# Altium project picr22-team-snax-mainboard.PrjPcb
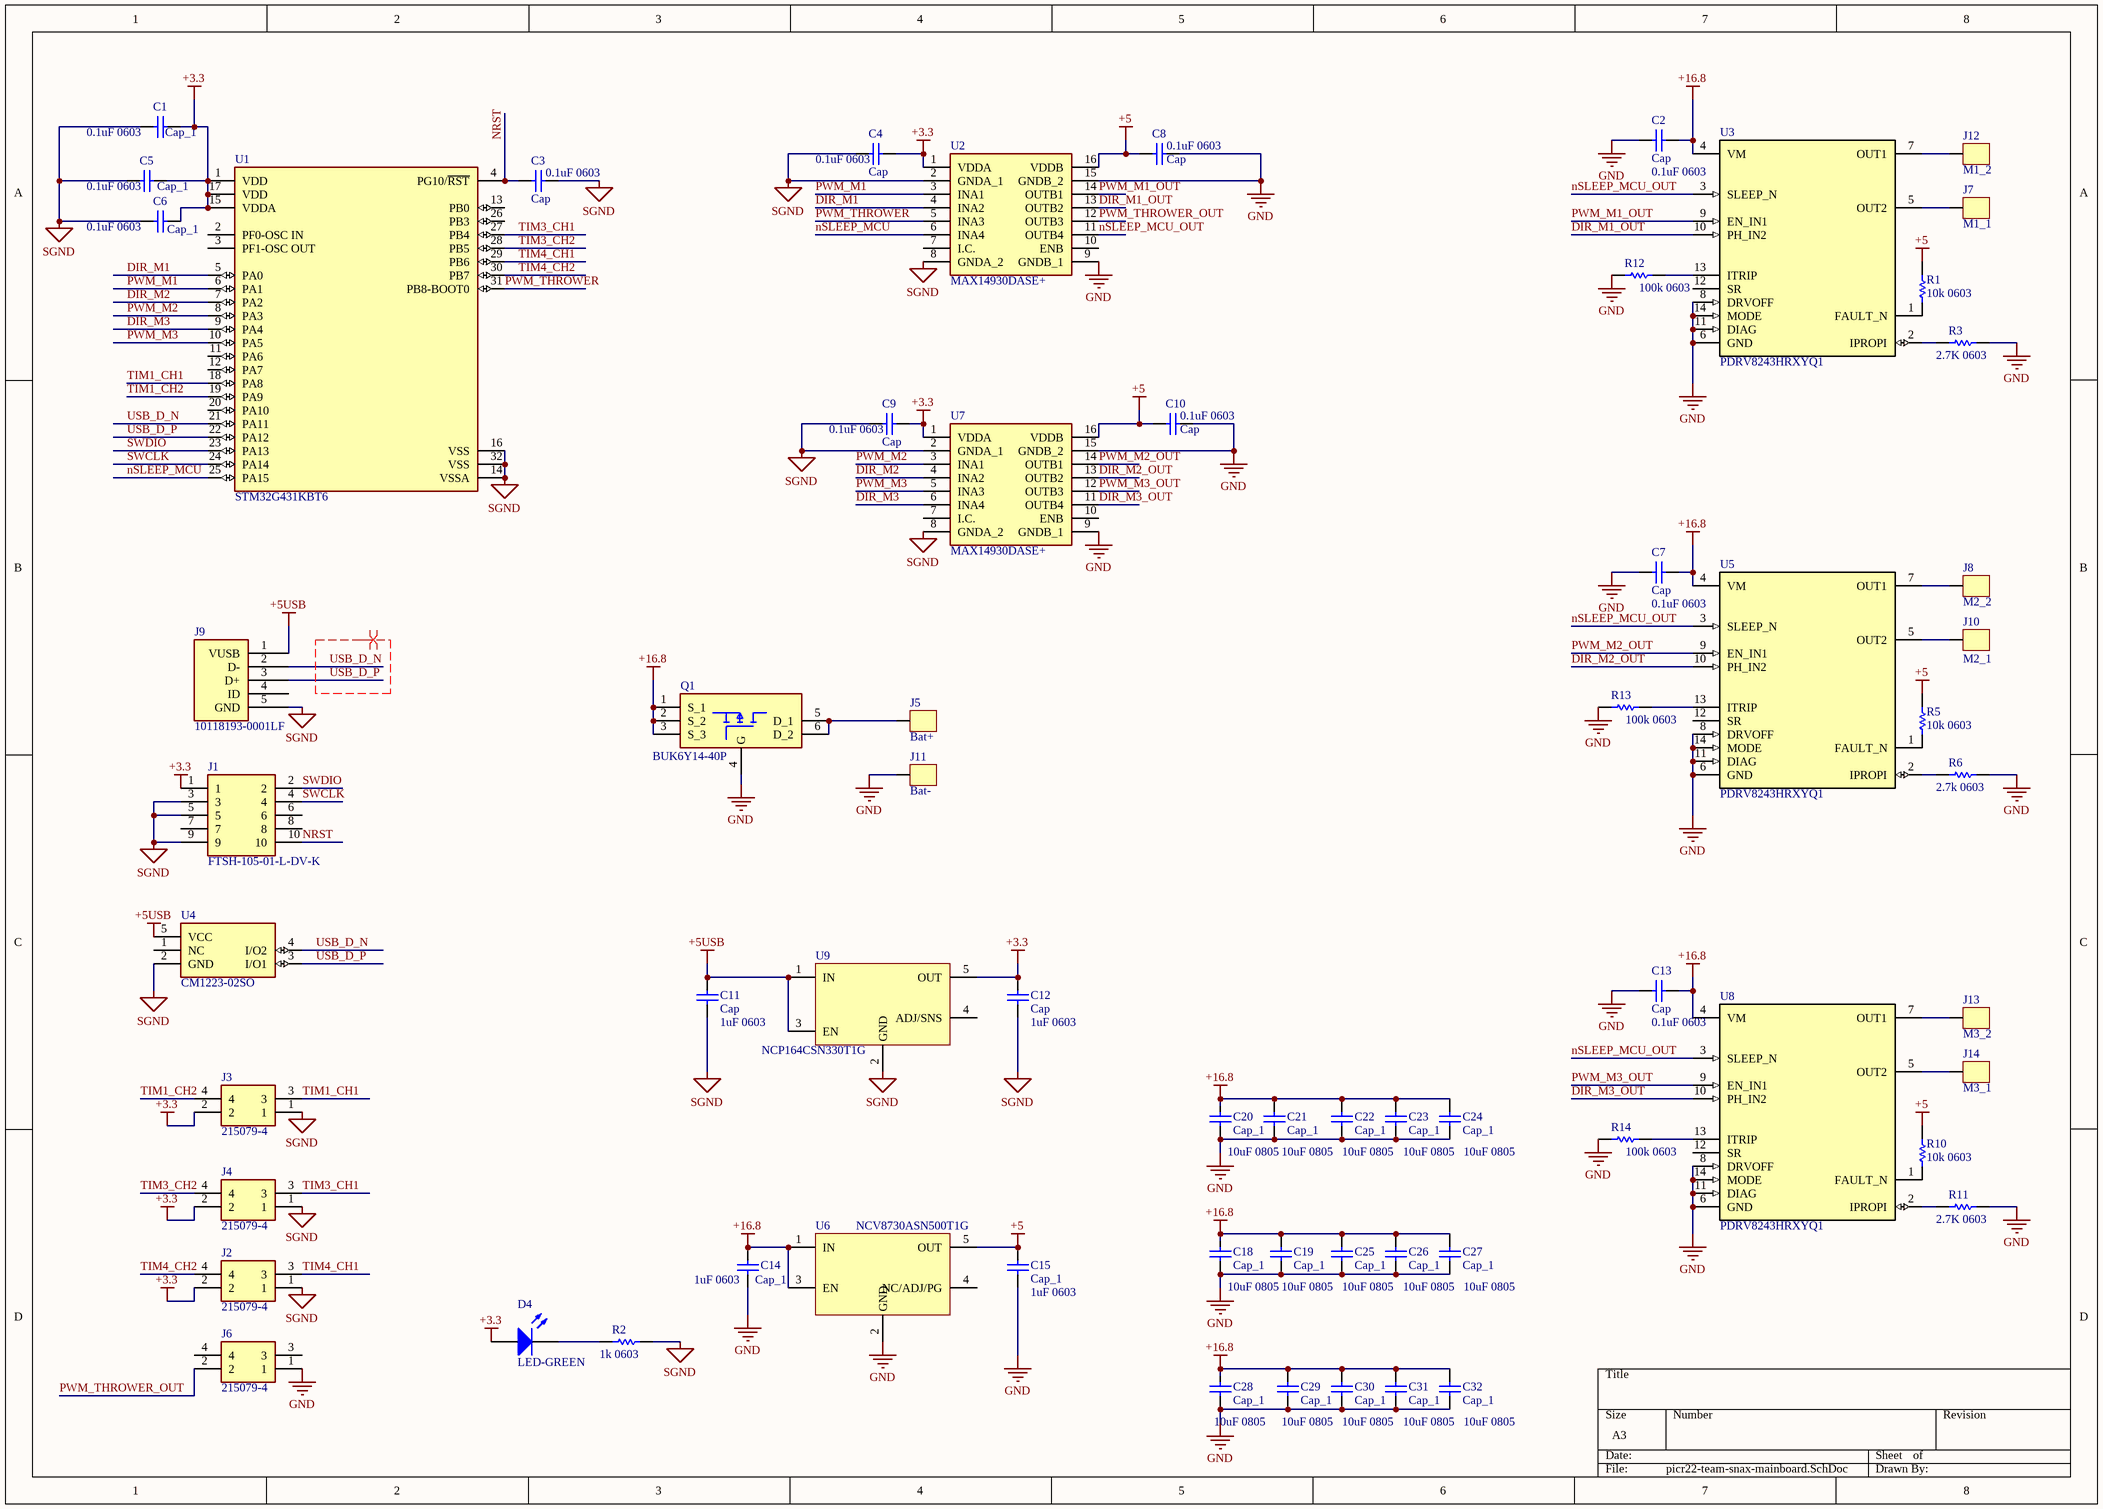
[diagram p0: picr22-team-snax-mainboard.SchDoc]
1 sheet, 65 parts. Net scope: global (net labels, ports and power ports of the same name join across sheets).
Board file: team-snax-mainboard.PcbDoc

## Sheet picr22-team-snax-mainboard.SchDoc
size A3; SheetNumber: 1; SheetTotal: 1

### Parts
C1  Cap_1  value 0.1uF 0603  [Cap_0603]
C2  Cap  value 0.1uF 0603  [Cap_0603]
C3  Cap  value 0.1uF 0603  [Cap_0603]
C4  Cap  value 0.1uF 0603  [Cap_0603]
C5  Cap_1  value 0.1uF 0603  [Cap_0603]
C6  Cap_1  value 0.1uF 0603  [Cap_0603]
C7  Cap  value 0.1uF 0603  [Cap_0603]
C8  Cap  value 0.1uF 0603  [Cap_0603]
C9  Cap  value 0.1uF 0603  [Cap_0603]
C10  Cap  value 0.1uF 0603  [Cap_0603]
C11  Cap  value 1uF 0603  [Cap_0603]
C12  Cap  value 1uF 0603  [Cap_0603]
C13  Cap  value 0.1uF 0603  [Cap_0603]
C14  Cap_1  value 1uF 0603  [Cap_0603]
C15  Cap_1  value 1uF 0603  [Cap_0603]
C18  Cap_1  value 10uF 0805  [CAP_0805]
C19  Cap_1  value 10uF 0805  [CAP_0805]
C20  Cap_1  value 10uF 0805  [CAP_0805]
C21  Cap_1  value 10uF 0805  [CAP_0805]
C22  Cap_1  value 10uF 0805  [CAP_0805]
C23  Cap_1  value 10uF 0805  [CAP_0805]
C24  Cap_1  value 10uF 0805  [CAP_0805]
C25  Cap_1  value 10uF 0805  [CAP_0805]
C26  Cap_1  value 10uF 0805  [CAP_0805]
C27  Cap_1  value 10uF 0805  [CAP_0805]
C28  Cap_1  value 10uF 0805  [CAP_0805]
C29  Cap_1  value 10uF 0805  [CAP_0805]
C30  Cap_1  value 10uF 0805  [CAP_0805]
C31  Cap_1  value 10uF 0805  [CAP_0805]
C32  Cap_1  value 10uF 0805  [CAP_0805]
D4  LED-GREEN  [LED0805G]
J1  FTSH-105-01-L-DV-K  [FTSH10501LDVK]
J2  215079-4  [2150794]
J3  215079-4  [2150794]
J4  215079-4  [2150794]
J5  Bat+  [3x3mm pad]
J6  215079-4  [2150794]
J7  M1_1  [3x3mm pad]
J8  M2_2  [3x3mm pad]
J9  10118193-0001LF  [USB port]
J10  M2_1  [3x3mm pad]
J11  Bat-  [3x3mm pad]
J12  M1_2  [3x3mm pad]
J13  M3_2  [3x3mm pad]
J14  M3_1  [3x3mm pad]
Q1  BUK6Y14-40P  [BUK6Y1440PX]
R1  10k 0603  [RES_0603]
R2  1k 0603  [RES_0603]
R3  2.7K 0603  [RES_0603]
R5  10k 0603  [RES_0603]
R6  2.7k 0603  [RES_0603]
R10  10k 0603  [RES_0603]
R11  2.7K 0603  [RES_0603]
R12  100k 0603  [RES_0603]
R13  100k 0603  [RES_0603]
R14  100k 0603  [RES_0603]
U1  STM32G431KBT6  [FP-LQFP32-5V-IPC_B]
U2  MAX14930DASE+  [SOIC127P1032X265-16N]
U3  PDRV8243HRXYQ1  [RXY0014A-MFG]
U4  CM1223-02SO  [SOT23-5]
U5  PDRV8243HRXYQ1  [RXY0014A-MFG]
U6  NCV8730ASN500T1G  [SOT23-5]
U7  MAX14930DASE+  [SOIC127P1032X265-16N]
U8  PDRV8243HRXYQ1  [RXY0014A-MFG]
U9  NCP164CSN330T1G  [SOT23-5]

### Nets
+3.3: C1.2 C4.1 C5.2 C6.2 C9.1 C12.2 D4.A J1.1 J2.2 J3.2 J4.2 U1.1(VDD) U1.15(VDDA) U1.17(VDD) U2.1(VDDA) U7.1(VDDA) U9.5(OUT)
+5: C8.2 C10.2 C15.2 R1.2 R5.2 R10.2 U2.16(VDDB) U6.5(OUT) U7.16(VDDB)
+5USB: C11.2 J9.1(VUSB) U4.5(VCC) U9.1(IN) U9.3(EN)
+16.8: C2.2 C7.2 C13.2 C14.2 C18.2 C19.2 C20.2 C21.2 C22.2 C23.2 C24.2 C25.2 C26.2 C27.2 C28.2 C29.2 C30.2 C31.2 C32.2 Q1.1(S_1) Q1.2(S_2) Q1.3(S_3) U3.4(VM) U5.4(VM) U6.1(IN) U6.3(EN) U8.4(VM)
GND: C2.1 C7.1 C8.1 C10.1 C13.1 C14.1 C15.1 C18.1 C19.1 C20.1 C21.1 C22.1 C23.1 C24.1 C25.1 C26.1 C27.1 C28.1 C29.1 C30.1 C31.1 C32.1 J6.1 J11.1 Q1.4(G) R3.2 R6.2 R11.2 R12.1 R13.1 R14.1 U2.9(GNDB_1) U2.15(GNDB_2) U3.6(GND) U3.8(DRVOFF) U3.11(DIAG) U3.14(MODE) U5.6(GND) U5.8(DRVOFF) U5.11(DIAG) U5.14(MODE) U6.2(GND) U7.9(GNDB_1) U7.15(GNDB_2) U8.6(GND) U8.8(DRVOFF) U8.11(DIAG) U8.14(MODE)
SGND: C1.1 C3.1 C4.2 C5.1 C6.1 C9.2 C11.1 C12.1 J1.3 J1.5 J1.9 J2.1 J3.1 J4.1 J9.5(GND) R2.2 U1.14(VSSA) U1.16(VSS) U1.32(VSS) U2.2(GNDA_1) U2.8(GNDA_2) U4.2(GND) U7.2(GNDA_1) U7.8(GNDA_2) U9.2(GND)
DIR_M1: U1.5(PA0) U2.4(INA2)
DIR_M1_OUT: U2.13(OUTB2) U3.10(PH_IN2)
DIR_M2: U1.7(PA2) U7.4(INA2)
DIR_M2_OUT: U5.10(PH_IN2) U7.13(OUTB2)
DIR_M3: U1.9(PA4) U7.6(INA4)
DIR_M3_OUT: U7.11(OUTB4) U8.10(PH_IN2)
NRST: C3.2 J1.10 U1.4(PG10/~{RST})
nSLEEP_MCU: U1.25(PA15) U2.6(INA4)
nSLEEP_MCU_OUT: U2.11(OUTB4) U3.3(SLEEP_N) U5.3(SLEEP_N) U8.3(SLEEP_N)
PWM_M1: U1.6(PA1) U2.3(INA1)
PWM_M1_OUT: U2.14(OUTB1) U3.9(EN_IN1)
PWM_M2: U1.8(PA3) U7.3(INA1)
PWM_M2_OUT: U5.9(EN_IN1) U7.14(OUTB1)
PWM_M3: U1.10(PA5) U7.5(INA3)
PWM_M3_OUT: U7.12(OUTB3) U8.9(EN_IN1)
PWM_THROWER: U1.31(PB8-BOOT0) U2.5(INA3)
PWM_THROWER_OUT: J6.2 U2.12(OUTB3)
SWCLK: J1.4 U1.24(PA14)
SWDIO: J1.2 U1.23(PA13)
TIM1_CH1: J3.3 U1.18(PA8)
TIM1_CH2: J3.4 U1.19(PA9)
TIM3_CH1: J4.3 U1.27(PB4)
TIM3_CH2: J4.4 U1.28(PB5)
TIM4_CH1: J2.3 U1.29(PB6)
TIM4_CH2: J2.4 U1.30(PB7)
USB_D_N: J9.2(D-) U1.21(PA11) U4.4(I/O2)
USB_D_P: J9.3(D+) U1.22(PA12) U4.3(I/O1)
NetD4_K: D4.K R2.1
NetJ5_1: J5.1 Q1.5(D_1) Q1.6(D_2)
NetJ7_1: J7.1 U3.5(OUT2)
NetJ8_1: J8.1 U5.7(OUT1)
NetJ10_1: J10.1 U5.5(OUT2)
NetJ12_1: J12.1 U3.7(OUT1)
NetJ13_1: J13.1 U8.7(OUT1)
NetJ14_1: J14.1 U8.5(OUT2)
NetR1_1: R1.1 U3.1(FAULT_N)
NetR3_1: R3.1 U3.2(IPROPI)
NetR5_1: R5.1 U5.1(FAULT_N)
NetR6_1: R6.1 U5.2(IPROPI)
NetR10_1: R10.1 U8.1(FAULT_N)
NetR11_1: R11.1 U8.2(IPROPI)
NetR12_2: R12.2 U3.13(ITRIP)
NetR13_2: R13.2 U5.13(ITRIP)
NetR14_2: R14.2 U8.13(ITRIP)

Not connected (* = marked no-connect by the designer): J1 6 7 8; J6 3 4; J9 4(ID); U1 2(PF0-OSC_IN) 3(PF1-OSC_OUT) 11(PA6) 12(PA7) 13(PB0) 20(PA10) 26(PB3); U2 7(I.C.) 10(ENB); U3 12(SR); U4 1(NC); U5 12(SR); U6 4(NC/ADJ/PG); U7 7(I.C.) 10(ENB); U8 12(SR); U9 4(ADJ/SNS)

### Layout directives
differential pair; differential pair class USB: USB_D_N, USB_D_P

### Library data of the parts
C1-C15 = Cap: Capacitor; Published: 8-Jun-2000; LatestRevisionDate: 17-Jul-2002; LatestRevisionNote: Re-released for DXP Platform.; PackageReference: RAD-0.3; Publisher: Altium Limited; PackageDescription: Radial Cap, Thru-Hole; 2 Leads; 0.3 in Pin Spacing
C18-C32 = Cap_1: Capacitor; Published: 8-Jun-2000; LatestRevisionDate: 17-Jul-2002; LatestRevisionNote: Re-released for DXP Platform.; PackageReference: RAD-0.3; Publisher: Altium Limited; PackageDescription: Radial Cap, Thru-Hole; 2 Leads; 0.3 in Pin Spacing
D4 = SMD 0805 LED-GREEN: GREEN  LED,Case 0805; Supplier 1: Farnell; Supplier Part Number 1: 1716766
J1 = FTSH-105-01-L-DV-K: Connector; Manufacturer_Name: SAMTEC; Datasheet Link: https://www.arrow.com/en/products/ftsh-105-01-l-dv-k/samtec; Height: 6.1mm; Manufacturer_Part_Number: FTSH-105-01-L-DV-K; Mouser Part Number: 200-FTSH10501LDVK; Mouser Price/Stock: https://www.mouser.co.uk/ProductDetail/Samtec/FTSH-105-01-L-DV-K?qs=%252B5JSS813miOqo3Vy%252BvhCFg%3D%3D; Arrow Part Number: FTSH-105-01-L-DV-K; Arrow Price/Stock: https://www.arrow.com/en/products/ftsh-105-01-l-dv-k/samtec?region=europe
J2-J4 J6 = 215079-4: Connector; Manufacturer_Name: TE Connectivity; Datasheet Link: https://www.te.com/commerce/DocumentDelivery/DDEController?Action=srchrtrv&DocNm=215079&DocType=Customer+Drawing&DocLang=English; Height: 4.2mm; Manufacturer_Part_Number: 215079-4; Mouser Part Number: 571-215079-4; Mouser Price/Stock: https://www.mouser.co.uk/ProductDetail/TE-Connectivity/215079-4?qs=O3N86PA0UL%252BdoZEVcFx8sQ%3D%3D; Arrow Part Number: 215079-4; Arrow Price/Stock: https://www.arrow.com/en/products/215079-4/te-connectivity
J5 J7 J8 J10-J14 = Connector pad
J9 = 10118193-0001LF: USB - micro B USB 2.0 Receptacle Connector 5 Position Surface Mount, Right Angle; Through Hole; MF: Amphenol ICC; Availability: Unavailable; SnapEDA_Link: https://www.snapeda.com/parts/10118193-0001LF/Amphenol%20FCI/view-part/2758989/?ref=snap; MP: 10118193-0001LF; Price: None; Value: *; Package: None
Q1 = BUK6Y14-40PX: MOSFET (P-Channel); Manufacturer_Name: Nexperia; Datasheet Link: https://assets.nexperia.com/documents/data-sheet/BUK6Y14-40P.pdf; Height: 1.2mm; Manufacturer_Part_Number: BUK6Y14-40PX; Mouser Part Number: 771-BUK6Y14-40PX; Mouser Price/Stock: https://www.mouser.co.uk/ProductDetail/Nexperia/BUK6Y14-40PX?qs=vmHwEFxEFR91d%252BcXKqAEkw%3D%3D
R1-R3 R5 R6 R10-R14 = Res1: Resistor; Published: 8-Jun-2000; LatestRevisionDate: 17-Jul-2002; LatestRevisionNote: Re-released for DXP Platform.; PackageReference: AXIAL-0.3; Publisher: Altium Limited; PackageDescription: Axial Device, Thru-Hole; 2 Leads; 0.3 in Pin Spacing
U1 = CMP-12105-000140-1: IC MCU 32BIT 128KB FLASH 32LQFP
U2 U7 = MAX14930DAWE+: Integrated Circuit; Manufacturer_Name: Maxim Integrated; Datasheet Link: https://datasheets.maximintegrated.com/en/ds/MAX14130-MAX14932.pdf; Height: 2.65mm; Manufacturer_Part_Number: MAX14930DAWE+; Mouser Part Number: 700-MAX14930DAWE+; Mouser Price/Stock: https://www.mouser.co.uk/ProductDetail/Maxim-Integrated/MAX14930DAWE%2b?qs=AAveGqk956FMXGKxABEd7w%3D%3D
U3 U5 U8 = PDRV8243HRXYQ1: No Description Available; Mfr_Name: Texas Instruments; Type: DEV; RefDes: RefDes; Copyright: Copyright (C) 2022 Ultra Librarian. All rights reserved.; Manufacturer_Part_Number: PDRV8243HRXYQ1
U4 = SP3003-02JTG: Integrated Circuit; Manufacturer_Name: LITTELFUSE; Datasheet Link: https://datasheet.datasheetarchive.com/originals/distributors/Datasheets-DGA26/1840396.pdf; Height: 1.1mm; Manufacturer_Part_Number: SP3003-02JTG; Mouser Part Number: 576-SP3003-02JTG; Mouser Price/Stock: https://www.mouser.co.uk/ProductDetail/Littelfuse/SP3003-02JTG?qs=je4hkJKt%2FJ1VE%2FhJSW73jg%3D%3D; Arrow Part Number: SP3003-02JTG; Arrow Price/Stock: https://www.arrow.com/en/products/sp3003-02jtg/littelfuse?region=nac
U9 = NCV8730ASN500T1G_1